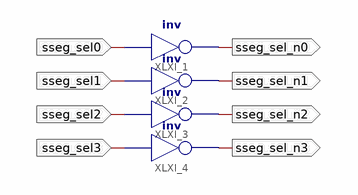
[diagram p0: schematic sheet 1]
// Xilinx ISE schematic ECE281_Celiano_Lab1_display_en.sch (spartan3e) as structural Verilog: 4 symbols, 8 ports
module ECE281_Celiano_Lab1_display_en (
  input  sseg_sel0,
  input  sseg_sel1,
  input  sseg_sel2,
  input  sseg_sel3,
  output sseg_sel_n0,
  output sseg_sel_n1,
  output sseg_sel_n2,
  output sseg_sel_n3
);

  not XLXI_1 (sseg_sel_n0, sseg_sel0);
  not XLXI_2 (sseg_sel_n1, sseg_sel1);
  not XLXI_3 (sseg_sel_n2, sseg_sel2);
  not XLXI_4 (sseg_sel_n3, sseg_sel3);
endmodule
